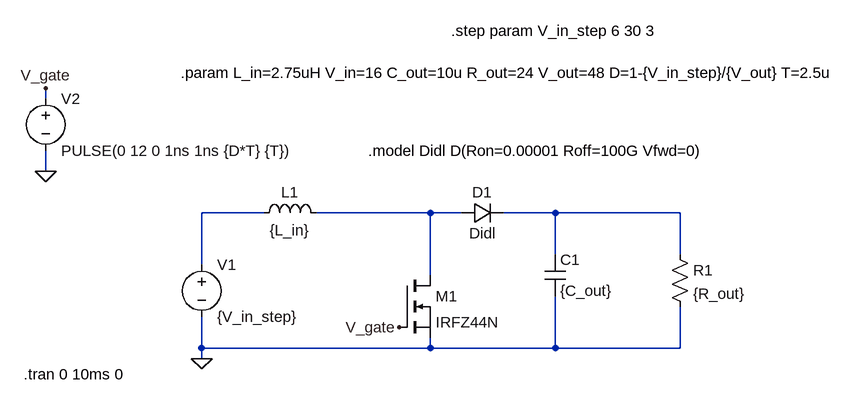
[diagram p0: schematic Q2_DCM_min_capacitor_simulation.asc]
Q2_DCM_min_capacitor_simulation.asc, the LTspice schematic file:
Version 4
SHEET 1 1120 680
WIRE -240 -48 -240 -64
WIRE -240 64 -240 32
WIRE 96 128 0 128
WIRE 352 128 176 128
WIRE 400 128 352 128
WIRE 544 128 464 128
WIRE 736 128 544 128
WIRE 544 192 544 128
WIRE 736 192 736 128
WIRE 0 208 0 128
WIRE 352 224 352 128
WIRE 0 336 0 288
WIRE 352 336 352 320
WIRE 352 336 0 336
WIRE 544 336 544 256
WIRE 544 336 352 336
WIRE 736 336 736 272
WIRE 736 336 544 336
WIRE 0 352 0 336
FLAG 0 352 0
FLAG -240 64 0
FLAG -240 -64 V_gate
FLAG 304 304 V_gate
SYMBOL ind 80 144 R270
WINDOW 0 32 56 VTop 2
WINDOW 3 5 56 VBottom 2
SYMATTR InstName L1
SYMATTR Value {L_in}
SYMBOL voltage 0 192 R0
SYMATTR InstName V1
SYMATTR Value {V_in_step}
SYMBOL nmos 304 224 R0
SYMATTR InstName M1
SYMATTR Value IRFZ44N
SYMBOL voltage -240 -64 R0
WINDOW 123 0 0 Left 0
WINDOW 39 0 0 Left 0
SYMATTR InstName V2
SYMATTR Value PULSE(0 12 0 1ns 1ns {D*T} {T})
SYMBOL diode 400 144 R270
WINDOW 0 32 32 VTop 2
WINDOW 3 0 32 VBottom 2
SYMATTR InstName D1
SYMATTR Value Didl
SYMBOL cap 528 192 R0
SYMATTR InstName C1
SYMATTR Value {C_out}
SYMATTR SpiceLine IC={V_out}
SYMBOL res 720 176 R0
SYMATTR InstName R1
SYMATTR Value {R_out}
TEXT -32 -88 Left 2 !.param L_in=2.75uH V_in=16 C_out=10u R_out=24 V_out=48 D=1-{V_in_step}/{V_out} T=2.5u
TEXT -274 376 Left 2 !.tran 0 10ms 0
TEXT 256 32 Left 2 !.model Didl D(Ron=0.00001 Roff=100G Vfwd=0)
TEXT 384 -152 Left 2 !.step param V_in_step 6 30 3

The netlist it stands for:
* Q2_DCM_min_capacitor_simulation.asc
L1 N001 N002 {L_in}
V1 N001 0 {V_in_step}
M1 N002 V_gate 0 0 IRFZ44N
V2 V_gate 0 PULSE(0 12 0 1ns 1ns {D*T} {T})
D1 N002 N003 Didl
C1 N003 0 {C_out} IC={V_out}
R1 N003 0 {R_out}
.model D D
.lib standard.dio
.model NMOS NMOS
.model PMOS PMOS
.lib standard.mos
.param L_in=2.75uH V_in=16 C_out=10u R_out=24 V_out=48 D=1-{V_in_step}/{V_out} T=2.5u
.tran 0 10ms 0
.model Didl D(Ron=0.00001 Roff=100G Vfwd=0)
.step param V_in_step 6 30 3
.backanno
.end